# EAGLE design Transistor_GPIO (EAGLE 9.5.1)
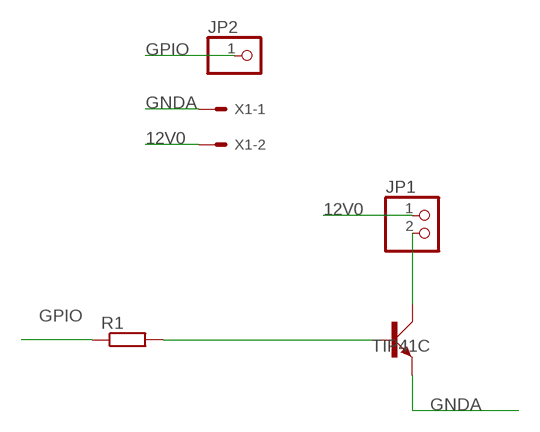
[diagram p0: schematic, sheet 1]

## Parts
JP1  PINHD-1X2  [1X02]
JP2  PINHD-1X1  [1X01]
Q1  TIP41C  [TO220AV]
R1  R-EU_0207/10  [0207/10]
X1  KK-156-2  [KK-156-2]

## Nets
12V0: JP1.1 X1.2
GNDA: Q1.E X1.1
GPIO: JP2.1 R1.1
N$1: JP1.2 Q1.C
N$2: Q1.B R1.2

## Library data of the parts
JP1 = pinhead:PINHD-1X2: PIN HEADER
JP2 = pinhead:PINHD-1X1: PIN HEADER
Q1 = transistor-power:TIP41C: NPN TRANSISTOR
R1 = resistor:R-EU_: RESISTOR, European symbol
X1 = con-molex:KK-156-2: KK 156 HEADER Source: http://www.molex.com/pdm_docs/sd/026604100_sd.pdf; MF: MOLEX; OC_FARNELL: unknown; OC_NEWARK: unknown

## Board
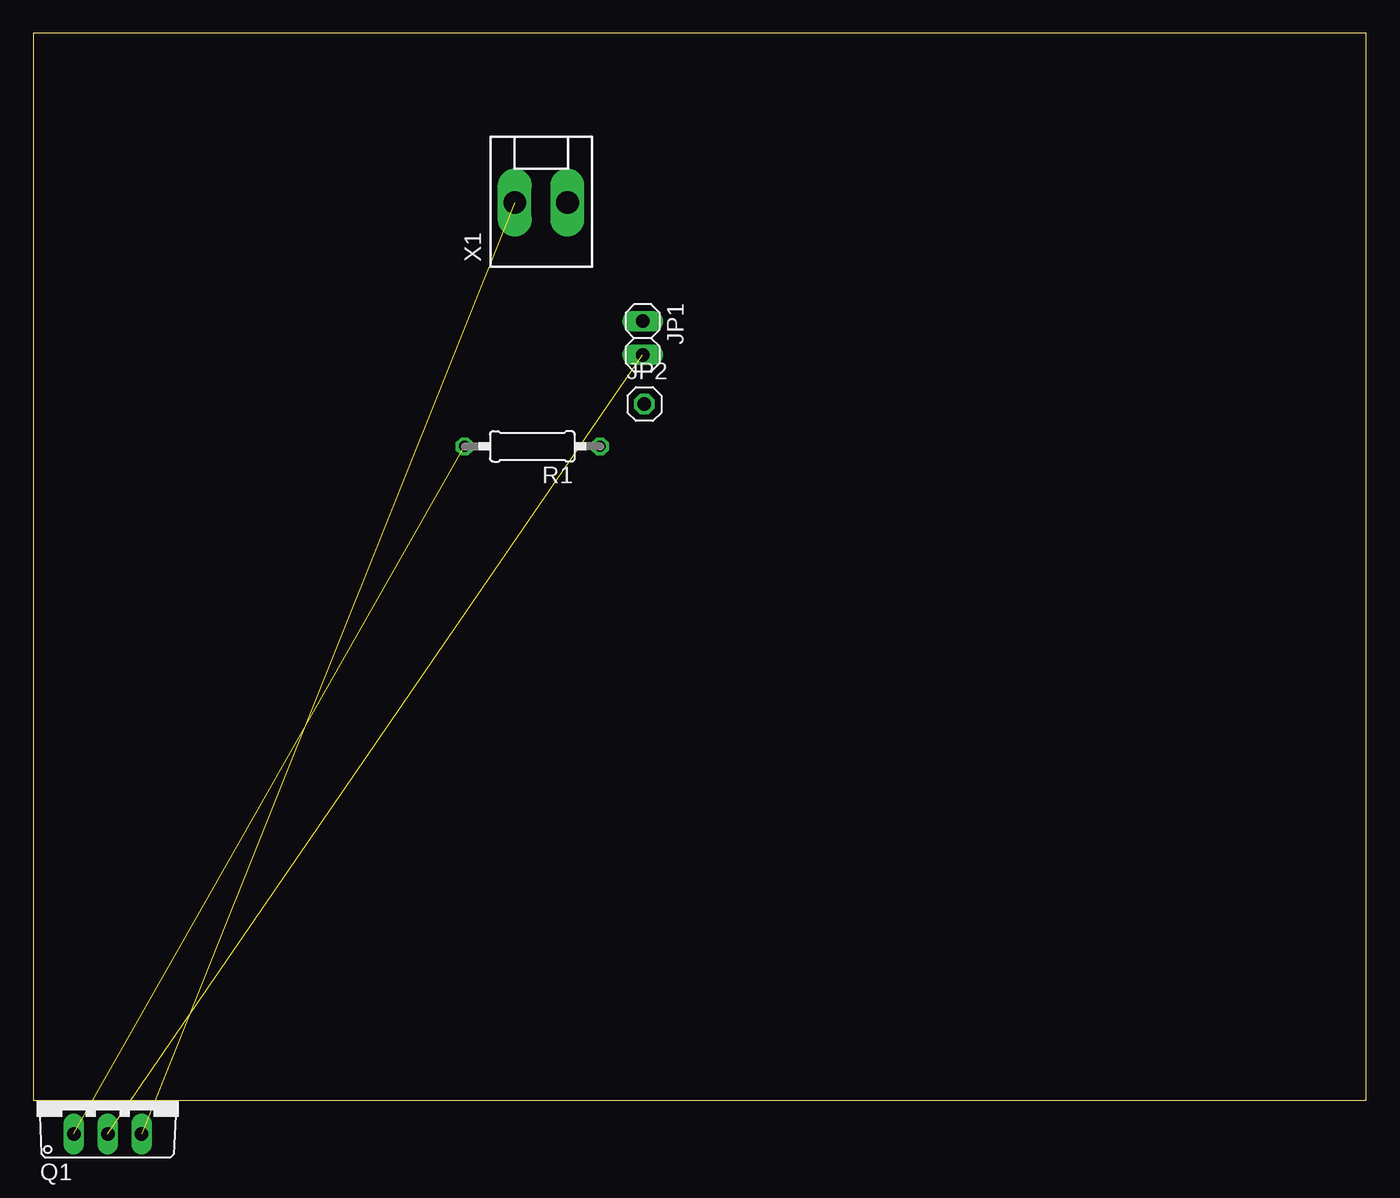
[diagram p1: board, top side]
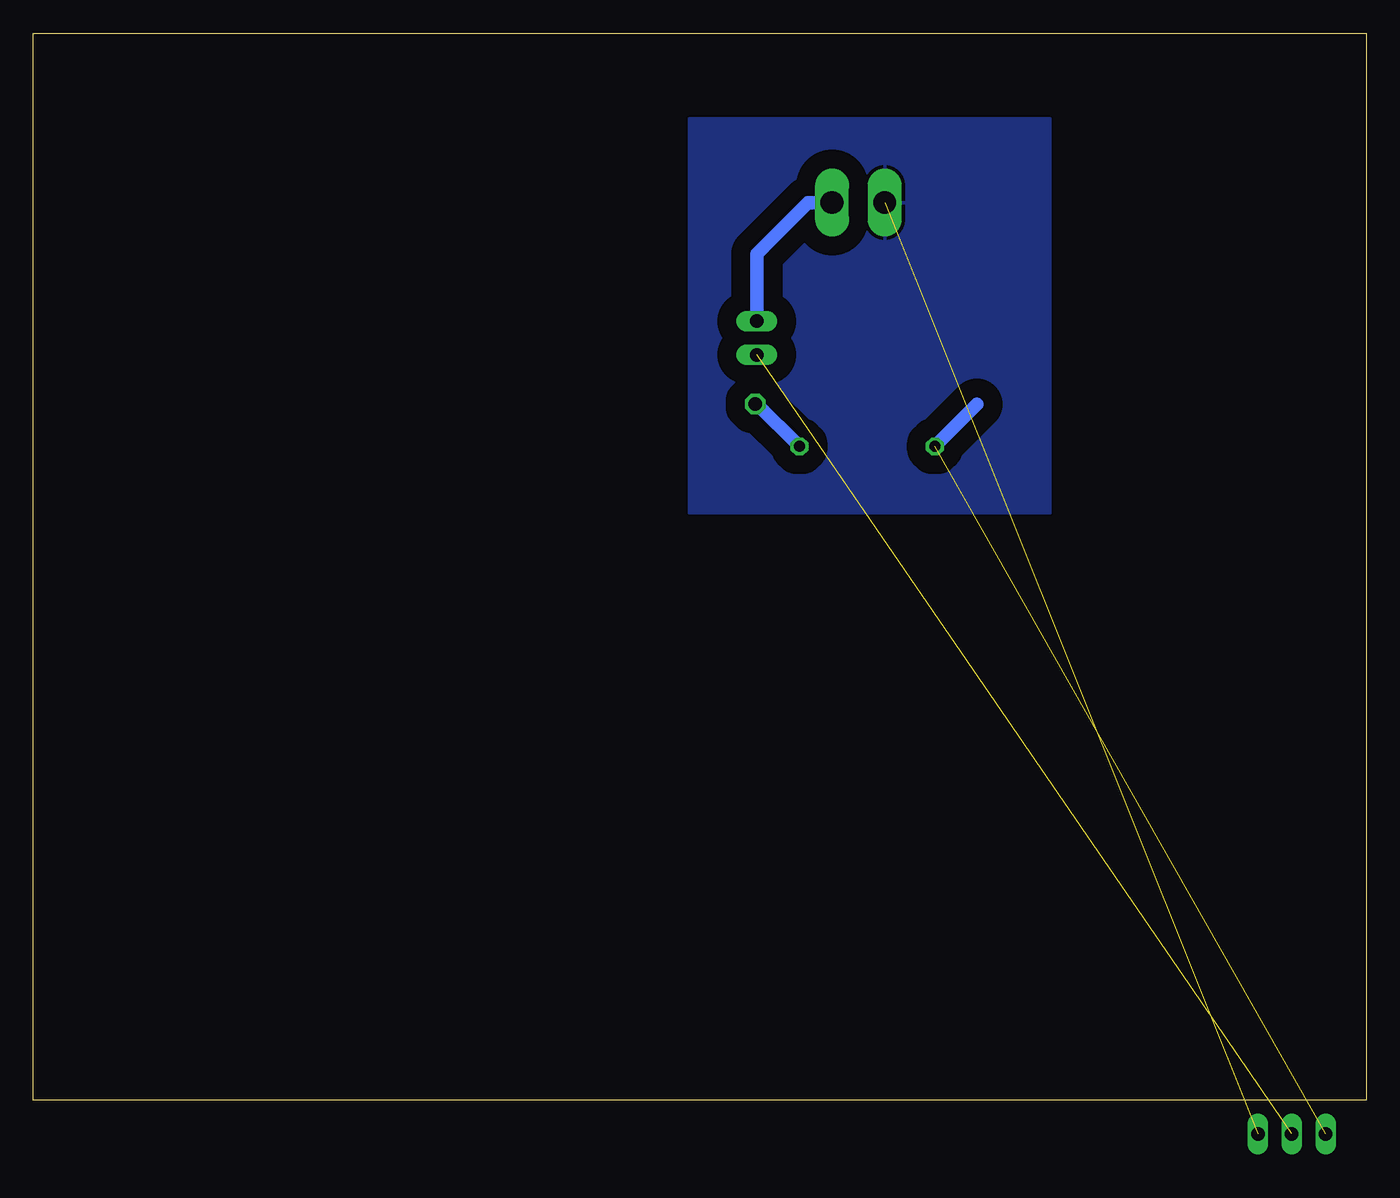
[diagram p2: board, bottom side, seen from below]

Size 100 x 80 mm. Coordinates in mm from the lower left corner, seen from the top.
Outline: 0,0 100,0 100,80 0,80 0,0
Copper layers (1*16): Top 0.035mm / dielectric 1.5mm / Bottom 0.035mm
Design rules "default": minimum track width 6mil, minimum drill 0.35mm, track to track 6mil, track to pad 6mil, pad to pad 6mil, via to via 6mil, smd to smd 6mil, copper to edge 40mil, drill to drill 6mil, minimum pad ring 10mil, minimum via ring 8mil, stop-mask expansion 4mil, vias tented up to drill 0mil, thermal gap 10mil

### Footprints (pad centres in the part's own frame; a part is rotated, then mirrored left to right if it is on the bottom)
1X02 = drill 1.016 long: 1 -1.27,0; 2 1.27,0
1X01 = drill 1.016 octagon: 1 0,0
TO220AV = drill 1.016 long: B -2.54,-2.54; C 0,-2.54; E 2.54,-2.54
0207/10 = drill 0.813 octagon: 1 -5.08,0; 2 5.08,0
KK-156-2 = drill 1.7 pad 2.184 long: 1 -1.98,0; 2 1.98,0

### Placement (x,y rotation side)
JP1  45.72,57.15 270 top
JP2  45.85,52.2 0 top
Q1  5.59,0 0 top
R1  37.44,49.02 180 top
X1  38.1,67.31 0 top

### Tracks (layer width: path | path; a pad name or v marks a point on that pad's centre or on a via)
12V0
  Bottom 1.016: JP1.1 45.72,63.48 41.88,67.31 X1.2
GNDA  (1 unrouted)
  pour Bottom (isolate 1.422): 23.7,43.97 50.8,43.97 50.8,73.66 23.7,73.66
GPIO
  Bottom 1.016: R1.1 45.7,52.2 JP2.1
N$1  (1 unrouted)
N$2  (1 unrouted)
  Bottom 1.016: R1.2 29.21,52.17